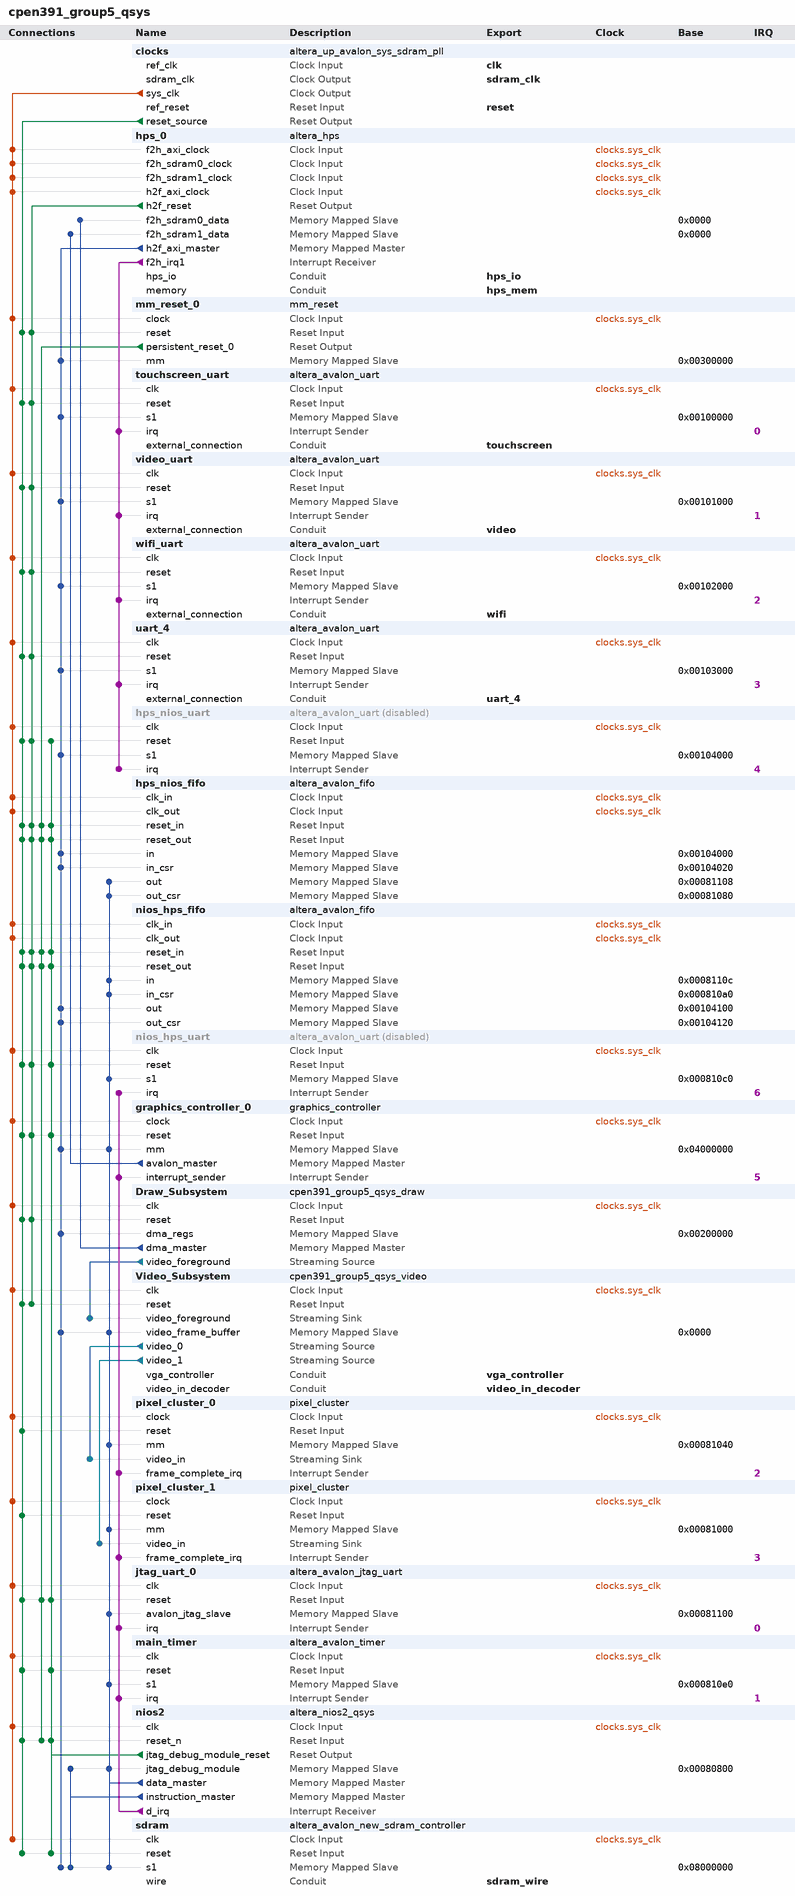
[diagram p0: system contents]
# Platform Designer (Qsys) system cpen391_group5_qsys, Cyclone V 5CSEMA5F31C6
# Parameters at their usual value, and those the tool derives, are not listed.
package require -exact qsys 15.0
create_system cpen391_group5_qsys
set_project_property DEVICE_FAMILY {Cyclone V}
set_project_property DEVICE 5CSEMA5F31C6

add_instance clocks altera_up_avalon_sys_sdram_pll 15.0
set_instance_parameter_value clocks CV_boards DE1-SoC
set_instance_parameter_value clocks gui_outclk 50.0
set_instance_parameter_value clocks gui_refclk 50.0

add_instance hps_0 altera_hps 15.0
set_instance_parameter_value hps_0 EMAC1_Mode RGMII
set_instance_parameter_value hps_0 EMAC1_PinMuxing {HPS I/O Set 0}
set_instance_parameter_value hps_0 F2SCLK_COLDRST_Enable false
set_instance_parameter_value hps_0 F2SCLK_DBGRST_Enable false
set_instance_parameter_value hps_0 F2SCLK_WARMRST_Enable false
set_instance_parameter_value hps_0 F2SDRAM_Type {Avalon-MM Bidirectional,Avalon-MM Bidirectional}
set_instance_parameter_value hps_0 F2SDRAM_Width 64,64
set_instance_parameter_value hps_0 F2SINTERRUPT_Enable true
set_instance_parameter_value hps_0 F2S_Width 1
set_instance_parameter_value hps_0 FPGA_PERIPHERAL_OUTPUT_CLOCK_FREQ_EMAC0_GTX_CLK 100
set_instance_parameter_value hps_0 FPGA_PERIPHERAL_OUTPUT_CLOCK_FREQ_EMAC0_MD_CLK 2.5
set_instance_parameter_value hps_0 FPGA_PERIPHERAL_OUTPUT_CLOCK_FREQ_EMAC1_GTX_CLK 100
set_instance_parameter_value hps_0 FPGA_PERIPHERAL_OUTPUT_CLOCK_FREQ_EMAC1_MD_CLK 2.5
set_instance_parameter_value hps_0 HPS_PROTOCOL DDR3
set_instance_parameter_value hps_0 I2C0_Mode I2C
set_instance_parameter_value hps_0 I2C0_PinMuxing {HPS I/O Set 1}
set_instance_parameter_value hps_0 I2C1_Mode N/A
set_instance_parameter_value hps_0 I2C1_PinMuxing Unused
set_instance_parameter_value hps_0 LWH2F_Enable false
set_instance_parameter_value hps_0 MEM_BANKADDR_WIDTH 3
set_instance_parameter_value hps_0 MEM_CLK_FREQ 400.0
set_instance_parameter_value hps_0 MEM_COL_ADDR_WIDTH 10
set_instance_parameter_value hps_0 MEM_DQ_WIDTH 32
set_instance_parameter_value hps_0 MEM_DRV_STR RZQ/7
set_instance_parameter_value hps_0 MEM_ROW_ADDR_WIDTH 15
set_instance_parameter_value hps_0 MEM_RTT_NOM RZQ/4
set_instance_parameter_value hps_0 MEM_RTT_WR RZQ/4
set_instance_parameter_value hps_0 MEM_TCL 11
set_instance_parameter_value hps_0 MEM_TFAW_NS 30.0
set_instance_parameter_value hps_0 MEM_TRAS_NS 35.0
set_instance_parameter_value hps_0 MEM_TRCD_NS 13.75
set_instance_parameter_value hps_0 MEM_TRFC_NS 260.0
set_instance_parameter_value hps_0 MEM_TRP_NS 13.75
set_instance_parameter_value hps_0 MEM_VENDOR Other
set_instance_parameter_value hps_0 MEM_WTCL 8
set_instance_parameter_value hps_0 QSPI_Mode {1 SS}
set_instance_parameter_value hps_0 QSPI_PinMuxing {HPS I/O Set 0}
set_instance_parameter_value hps_0 REF_CLK_FREQ 25.0
set_instance_parameter_value hps_0 S2F_Width 1
set_instance_parameter_value hps_0 SDIO_Mode {4-bit Data}
set_instance_parameter_value hps_0 SDIO_PinMuxing {HPS I/O Set 0}
set_instance_parameter_value hps_0 SPIM1_Mode N/A
set_instance_parameter_value hps_0 SPIM1_PinMuxing Unused
set_instance_parameter_value hps_0 STM_Enable false
set_instance_parameter_value hps_0 TIMING_BOARD_AC_SKEW 0.02
set_instance_parameter_value hps_0 TIMING_BOARD_AC_TO_CK_SKEW 0.01
set_instance_parameter_value hps_0 TIMING_BOARD_DQ_TO_DQS_SKEW 0.05
set_instance_parameter_value hps_0 TIMING_BOARD_MAX_CK_DELAY 0.03
set_instance_parameter_value hps_0 TIMING_BOARD_MAX_DQS_DELAY 0.02
set_instance_parameter_value hps_0 TIMING_BOARD_SKEW_BETWEEN_DQS 0.06
set_instance_parameter_value hps_0 TIMING_BOARD_SKEW_CKDQS_DIMM_MAX 0.12
set_instance_parameter_value hps_0 TIMING_BOARD_SKEW_CKDQS_DIMM_MIN 0.06
set_instance_parameter_value hps_0 TIMING_BOARD_SKEW_WITHIN_DQS 0.01
set_instance_parameter_value hps_0 TIMING_TDH 65
set_instance_parameter_value hps_0 TIMING_TDQSCK 255
set_instance_parameter_value hps_0 TIMING_TDQSQ 125
set_instance_parameter_value hps_0 TIMING_TDS 30
set_instance_parameter_value hps_0 TIMING_TIH 140
set_instance_parameter_value hps_0 TIMING_TIS 180
set_instance_parameter_value hps_0 TIMING_TQSH 0.4
set_instance_parameter_value hps_0 UART0_Mode {No Flow Control}
set_instance_parameter_value hps_0 UART0_PinMuxing {HPS I/O Set 2}
set_instance_parameter_value hps_0 USB1_Mode SDR
set_instance_parameter_value hps_0 USB1_PinMuxing {HPS I/O Set 0}
set_instance_parameter_value hps_0 desired_cfg_clk_mhz 100.0
set_instance_parameter_value hps_0 desired_qspi_clk_mhz 400.0

add_instance mm_reset_0 mm_reset 1.0
set_instance_parameter_value mm_reset_0 ADDR_BITS 2
set_instance_parameter_value mm_reset_0 CYCLES 1000000
set_instance_parameter_value mm_reset_0 N_REGS 4
set_instance_parameter_value mm_reset_0 REG_BITS 32

add_instance touchscreen_uart altera_avalon_uart 15.0
set_instance_parameter_value touchscreen_uart baud 9600
set_instance_parameter_value touchscreen_uart dataBits 8
set_instance_parameter_value touchscreen_uart fixedBaud false
set_instance_parameter_value touchscreen_uart parity NONE
set_instance_parameter_value touchscreen_uart stopBits 1

add_instance video_uart altera_avalon_uart 15.0
set_instance_parameter_value video_uart baud 38400
set_instance_parameter_value video_uart dataBits 8
set_instance_parameter_value video_uart fixedBaud false
set_instance_parameter_value video_uart parity NONE
set_instance_parameter_value video_uart stopBits 1

add_instance wifi_uart altera_avalon_uart 15.0
set_instance_parameter_value wifi_uart baud 115200
set_instance_parameter_value wifi_uart dataBits 8
set_instance_parameter_value wifi_uart fixedBaud false
set_instance_parameter_value wifi_uart parity NONE
set_instance_parameter_value wifi_uart stopBits 1

add_instance uart_4 altera_avalon_uart 15.0
set_instance_parameter_value uart_4 baud 115200
set_instance_parameter_value uart_4 dataBits 8
set_instance_parameter_value uart_4 fixedBaud false
set_instance_parameter_value uart_4 parity NONE
set_instance_parameter_value uart_4 stopBits 1

add_instance hps_nios_uart altera_avalon_uart 15.0
set_instance_property hps_nios_uart ENABLED false
set_instance_parameter_value hps_nios_uart baud 115200
set_instance_parameter_value hps_nios_uart dataBits 8
set_instance_parameter_value hps_nios_uart fixedBaud true
set_instance_parameter_value hps_nios_uart parity NONE
set_instance_parameter_value hps_nios_uart stopBits 1

add_instance hps_nios_fifo altera_avalon_fifo 15.0
set_instance_parameter_value hps_nios_fifo bitsPerSymbol 16
set_instance_parameter_value hps_nios_fifo channelWidth 8
set_instance_parameter_value hps_nios_fifo errorWidth 8
set_instance_parameter_value hps_nios_fifo fifoDepth 64
set_instance_parameter_value hps_nios_fifo fifoInputInterfaceOptions AVALONMM_WRITE
set_instance_parameter_value hps_nios_fifo fifoOutputInterfaceOptions AVALONMM_READ
set_instance_parameter_value hps_nios_fifo singleClockMode false
set_instance_parameter_value hps_nios_fifo symbolsPerBeat 2
set_instance_parameter_value hps_nios_fifo useBackpressure false
set_instance_parameter_value hps_nios_fifo useIRQ false
set_instance_parameter_value hps_nios_fifo usePacket true
set_instance_parameter_value hps_nios_fifo useReadControl true

add_instance nios_hps_fifo altera_avalon_fifo 15.0
set_instance_parameter_value nios_hps_fifo bitsPerSymbol 16
set_instance_parameter_value nios_hps_fifo channelWidth 8
set_instance_parameter_value nios_hps_fifo errorWidth 8
set_instance_parameter_value nios_hps_fifo fifoDepth 64
set_instance_parameter_value nios_hps_fifo fifoInputInterfaceOptions AVALONMM_WRITE
set_instance_parameter_value nios_hps_fifo fifoOutputInterfaceOptions AVALONMM_READ
set_instance_parameter_value nios_hps_fifo singleClockMode false
set_instance_parameter_value nios_hps_fifo symbolsPerBeat 2
set_instance_parameter_value nios_hps_fifo useBackpressure false
set_instance_parameter_value nios_hps_fifo useIRQ false
set_instance_parameter_value nios_hps_fifo usePacket true
set_instance_parameter_value nios_hps_fifo useReadControl true

add_instance nios_hps_uart altera_avalon_uart 15.0
set_instance_property nios_hps_uart ENABLED false
set_instance_parameter_value nios_hps_uart baud 115200
set_instance_parameter_value nios_hps_uart dataBits 8
set_instance_parameter_value nios_hps_uart fixedBaud true
set_instance_parameter_value nios_hps_uart parity NONE
set_instance_parameter_value nios_hps_uart stopBits 1

add_instance graphics_controller_0 graphics_controller 1.0
set_instance_parameter_value graphics_controller_0 pixel_idle 0
set_instance_parameter_value graphics_controller_0 pixel_write 1
set_instance_parameter_value graphics_controller_0 rec_cmp_x 3
set_instance_parameter_value graphics_controller_0 rec_cmp_y 5
set_instance_parameter_value graphics_controller_0 rec_idle 0
set_instance_parameter_value graphics_controller_0 rec_inc_x 12
set_instance_parameter_value graphics_controller_0 rec_inc_y 22
set_instance_parameter_value graphics_controller_0 rec_init 1
set_instance_parameter_value graphics_controller_0 rec_write 34

add_instance Draw_Subsystem cpen391_group5_qsys_draw 1.0

add_instance Video_Subsystem cpen391_group5_qsys_video 1.0

add_instance pixel_cluster_0 pixel_cluster 1.0
set_instance_parameter_value pixel_cluster_0 ADDR_BITS 4
set_instance_parameter_value pixel_cluster_0 COLOR_BITS 8
set_instance_parameter_value pixel_cluster_0 COUNTER_BITS 16
set_instance_parameter_value pixel_cluster_0 N_CLUSTERS 4
set_instance_parameter_value pixel_cluster_0 N_COLORS 3
set_instance_parameter_value pixel_cluster_0 REG_BITS 32
set_instance_parameter_value pixel_cluster_0 X_MAX 320
set_instance_parameter_value pixel_cluster_0 X_Y_BITS 16
set_instance_parameter_value pixel_cluster_0 Y_MAX 240

add_instance pixel_cluster_1 pixel_cluster 1.0
set_instance_parameter_value pixel_cluster_1 ADDR_BITS 4
set_instance_parameter_value pixel_cluster_1 COLOR_BITS 8
set_instance_parameter_value pixel_cluster_1 COUNTER_BITS 16
set_instance_parameter_value pixel_cluster_1 N_CLUSTERS 4
set_instance_parameter_value pixel_cluster_1 N_COLORS 3
set_instance_parameter_value pixel_cluster_1 REG_BITS 32
set_instance_parameter_value pixel_cluster_1 X_MAX 320
set_instance_parameter_value pixel_cluster_1 X_Y_BITS 16
set_instance_parameter_value pixel_cluster_1 Y_MAX 240

add_instance jtag_uart_0 altera_avalon_jtag_uart 15.0
set_instance_parameter_value jtag_uart_0 simInteractiveOptions NO_INTERACTIVE_WINDOWS

add_instance main_timer altera_avalon_timer 15.0
set_instance_parameter_value main_timer period 1
set_instance_parameter_value main_timer periodUnits MSEC

add_instance nios2 altera_nios2_qsys 15.0
set_instance_parameter_value nios2 breakSlave nios2.jtag_debug_module
set_instance_parameter_value nios2 dcache_bursts true
set_instance_parameter_value nios2 dcache_size 1024
set_instance_parameter_value nios2 dcache_victim_buf_impl reg
set_instance_parameter_value nios2 exceptionSlave sdram.s1
set_instance_parameter_value nios2 icache_size 1024
set_instance_parameter_value nios2 impl Tiny
set_instance_parameter_value nios2 mmu_TLBMissExcSlave None
set_instance_parameter_value nios2 resetSlave sdram.s1
set_instance_parameter_value nios2 resetrequest_enabled true

add_instance sdram altera_avalon_new_sdram_controller 15.0
set_instance_parameter_value sdram TAC 5.4
set_instance_parameter_value sdram TRCD 15.0
set_instance_parameter_value sdram TRP 15.0
set_instance_parameter_value sdram casLatency 3
set_instance_parameter_value sdram columnWidth 10
set_instance_parameter_value sdram dataWidth 16
set_instance_parameter_value sdram generateSimulationModel false
set_instance_parameter_value sdram model single_Micron_MT48LC4M32B2_7_chip
set_instance_parameter_value sdram numberOfBanks 4
set_instance_parameter_value sdram numberOfChipSelects 1
set_instance_parameter_value sdram powerUpDelay 100.0
set_instance_parameter_value sdram refreshPeriod 7.8125
set_instance_parameter_value sdram rowWidth 13

# connections
add_connection clocks.sys_clk Draw_Subsystem.clk clock
add_connection clocks.sys_clk graphics_controller_0.clock clock
add_connection clocks.sys_clk hps_0.f2h_axi_clock clock
add_connection clocks.sys_clk hps_0.f2h_sdram0_clock clock
add_connection clocks.sys_clk hps_0.f2h_sdram1_clock clock
add_connection clocks.sys_clk hps_0.h2f_axi_clock clock
add_connection clocks.sys_clk hps_nios_fifo.clk_in clock
add_connection clocks.sys_clk hps_nios_fifo.clk_out clock
add_connection clocks.sys_clk hps_nios_uart.clk clock
add_connection clocks.sys_clk jtag_uart_0.clk clock
add_connection clocks.sys_clk main_timer.clk clock
add_connection clocks.sys_clk mm_reset_0.clock clock
add_connection clocks.sys_clk nios2.clk clock
add_connection clocks.sys_clk nios_hps_fifo.clk_in clock
add_connection clocks.sys_clk nios_hps_fifo.clk_out clock
add_connection clocks.sys_clk nios_hps_uart.clk clock
add_connection clocks.sys_clk pixel_cluster_0.clock clock
add_connection clocks.sys_clk pixel_cluster_1.clock clock
add_connection clocks.sys_clk sdram.clk clock
add_connection clocks.sys_clk touchscreen_uart.clk clock
add_connection clocks.sys_clk uart_4.clk clock
add_connection clocks.sys_clk Video_Subsystem.clk clock
add_connection clocks.sys_clk video_uart.clk clock
add_connection clocks.sys_clk wifi_uart.clk clock
add_connection clocks.reset_source Draw_Subsystem.reset reset
add_connection clocks.reset_source graphics_controller_0.reset reset
add_connection clocks.reset_source hps_nios_fifo.reset_in reset
add_connection clocks.reset_source hps_nios_fifo.reset_out reset
add_connection clocks.reset_source hps_nios_uart.reset reset
add_connection clocks.reset_source jtag_uart_0.reset reset
add_connection clocks.reset_source main_timer.reset reset
add_connection clocks.reset_source mm_reset_0.reset reset
add_connection clocks.reset_source nios2.reset_n reset
add_connection clocks.reset_source nios_hps_fifo.reset_in reset
add_connection clocks.reset_source nios_hps_fifo.reset_out reset
add_connection clocks.reset_source nios_hps_uart.reset reset
add_connection clocks.reset_source pixel_cluster_0.reset reset
add_connection clocks.reset_source pixel_cluster_1.reset reset
add_connection clocks.reset_source sdram.reset reset
add_connection clocks.reset_source touchscreen_uart.reset reset
add_connection clocks.reset_source uart_4.reset reset
add_connection clocks.reset_source Video_Subsystem.reset reset
add_connection clocks.reset_source video_uart.reset reset
add_connection clocks.reset_source wifi_uart.reset reset
add_connection hps_0.h2f_reset Draw_Subsystem.reset reset
add_connection hps_0.h2f_reset graphics_controller_0.reset reset
add_connection hps_0.h2f_reset hps_nios_fifo.reset_in reset
add_connection hps_0.h2f_reset hps_nios_fifo.reset_out reset
add_connection hps_0.h2f_reset hps_nios_uart.reset reset
add_connection hps_0.h2f_reset mm_reset_0.reset reset
add_connection hps_0.h2f_reset nios_hps_fifo.reset_in reset
add_connection hps_0.h2f_reset nios_hps_fifo.reset_out reset
add_connection hps_0.h2f_reset nios_hps_uart.reset reset
add_connection hps_0.h2f_reset touchscreen_uart.reset reset
add_connection hps_0.h2f_reset uart_4.reset reset
add_connection hps_0.h2f_reset Video_Subsystem.reset reset
add_connection hps_0.h2f_reset video_uart.reset reset
add_connection hps_0.h2f_reset wifi_uart.reset reset
add_connection mm_reset_0.persistent_reset_0 hps_nios_fifo.reset_in reset
add_connection mm_reset_0.persistent_reset_0 hps_nios_fifo.reset_out reset
add_connection mm_reset_0.persistent_reset_0 jtag_uart_0.reset reset
add_connection mm_reset_0.persistent_reset_0 nios2.reset_n reset
add_connection mm_reset_0.persistent_reset_0 nios_hps_fifo.reset_in reset
add_connection mm_reset_0.persistent_reset_0 nios_hps_fifo.reset_out reset
add_connection nios2.jtag_debug_module_reset graphics_controller_0.reset reset
add_connection nios2.jtag_debug_module_reset hps_nios_fifo.reset_in reset
add_connection nios2.jtag_debug_module_reset hps_nios_fifo.reset_out reset
add_connection nios2.jtag_debug_module_reset hps_nios_uart.reset reset
add_connection nios2.jtag_debug_module_reset jtag_uart_0.reset reset
add_connection nios2.jtag_debug_module_reset main_timer.reset reset
add_connection nios2.jtag_debug_module_reset nios2.reset_n reset
add_connection nios2.jtag_debug_module_reset nios_hps_fifo.reset_in reset
add_connection nios2.jtag_debug_module_reset nios_hps_fifo.reset_out reset
add_connection nios2.jtag_debug_module_reset nios_hps_uart.reset reset
add_connection nios2.jtag_debug_module_reset sdram.reset reset
add_connection Draw_Subsystem.dma_master hps_0.f2h_sdram0_data avalon
set_connection_parameter_value Draw_Subsystem.dma_master/hps_0.f2h_sdram0_data baseAddress 0x0000
add_connection graphics_controller_0.avalon_master hps_0.f2h_sdram1_data avalon
set_connection_parameter_value graphics_controller_0.avalon_master/hps_0.f2h_sdram1_data baseAddress 0x0000
add_connection hps_0.h2f_axi_master Draw_Subsystem.dma_regs avalon
set_connection_parameter_value hps_0.h2f_axi_master/Draw_Subsystem.dma_regs baseAddress 0x00200000
add_connection hps_0.h2f_axi_master graphics_controller_0.mm avalon
set_connection_parameter_value hps_0.h2f_axi_master/graphics_controller_0.mm baseAddress 0x04000000
add_connection hps_0.h2f_axi_master hps_nios_fifo.in avalon
set_connection_parameter_value hps_0.h2f_axi_master/hps_nios_fifo.in baseAddress 0x00104000
add_connection hps_0.h2f_axi_master hps_nios_fifo.in_csr avalon
set_connection_parameter_value hps_0.h2f_axi_master/hps_nios_fifo.in_csr baseAddress 0x00104020
add_connection hps_0.h2f_axi_master hps_nios_uart.s1 avalon
set_connection_parameter_value hps_0.h2f_axi_master/hps_nios_uart.s1 baseAddress 0x00104000
add_connection hps_0.h2f_axi_master mm_reset_0.mm avalon
set_connection_parameter_value hps_0.h2f_axi_master/mm_reset_0.mm baseAddress 0x00300000
add_connection hps_0.h2f_axi_master nios_hps_fifo.out avalon
set_connection_parameter_value hps_0.h2f_axi_master/nios_hps_fifo.out baseAddress 0x00104100
add_connection hps_0.h2f_axi_master nios_hps_fifo.out_csr avalon
set_connection_parameter_value hps_0.h2f_axi_master/nios_hps_fifo.out_csr baseAddress 0x00104120
add_connection hps_0.h2f_axi_master sdram.s1 avalon
set_connection_parameter_value hps_0.h2f_axi_master/sdram.s1 baseAddress 0x08000000
add_connection hps_0.h2f_axi_master touchscreen_uart.s1 avalon
set_connection_parameter_value hps_0.h2f_axi_master/touchscreen_uart.s1 baseAddress 0x00100000
add_connection hps_0.h2f_axi_master uart_4.s1 avalon
set_connection_parameter_value hps_0.h2f_axi_master/uart_4.s1 baseAddress 0x00103000
add_connection hps_0.h2f_axi_master Video_Subsystem.video_frame_buffer avalon
set_connection_parameter_value hps_0.h2f_axi_master/Video_Subsystem.video_frame_buffer baseAddress 0x0000
add_connection hps_0.h2f_axi_master video_uart.s1 avalon
set_connection_parameter_value hps_0.h2f_axi_master/video_uart.s1 baseAddress 0x00101000
add_connection hps_0.h2f_axi_master wifi_uart.s1 avalon
set_connection_parameter_value hps_0.h2f_axi_master/wifi_uart.s1 baseAddress 0x00102000
add_connection nios2.data_master graphics_controller_0.mm avalon
set_connection_parameter_value nios2.data_master/graphics_controller_0.mm baseAddress 0x04000000
add_connection nios2.data_master hps_nios_fifo.out avalon
set_connection_parameter_value nios2.data_master/hps_nios_fifo.out baseAddress 0x00081108
add_connection nios2.data_master hps_nios_fifo.out_csr avalon
set_connection_parameter_value nios2.data_master/hps_nios_fifo.out_csr baseAddress 0x00081080
add_connection nios2.data_master jtag_uart_0.avalon_jtag_slave avalon
set_connection_parameter_value nios2.data_master/jtag_uart_0.avalon_jtag_slave baseAddress 0x00081100
add_connection nios2.data_master main_timer.s1 avalon
set_connection_parameter_value nios2.data_master/main_timer.s1 baseAddress 0x000810e0
add_connection nios2.data_master nios2.jtag_debug_module avalon
set_connection_parameter_value nios2.data_master/nios2.jtag_debug_module baseAddress 0x00080800
add_connection nios2.data_master nios_hps_fifo.in avalon
set_connection_parameter_value nios2.data_master/nios_hps_fifo.in baseAddress 0x0008110c
add_connection nios2.data_master nios_hps_fifo.in_csr avalon
set_connection_parameter_value nios2.data_master/nios_hps_fifo.in_csr baseAddress 0x000810a0
add_connection nios2.data_master nios_hps_uart.s1 avalon
set_connection_parameter_value nios2.data_master/nios_hps_uart.s1 baseAddress 0x000810c0
add_connection nios2.data_master pixel_cluster_0.mm avalon
set_connection_parameter_value nios2.data_master/pixel_cluster_0.mm baseAddress 0x00081040
add_connection nios2.data_master pixel_cluster_1.mm avalon
set_connection_parameter_value nios2.data_master/pixel_cluster_1.mm baseAddress 0x00081000
add_connection nios2.data_master sdram.s1 avalon
set_connection_parameter_value nios2.data_master/sdram.s1 baseAddress 0x08000000
add_connection nios2.data_master Video_Subsystem.video_frame_buffer avalon
set_connection_parameter_value nios2.data_master/Video_Subsystem.video_frame_buffer baseAddress 0x0000
add_connection nios2.instruction_master nios2.jtag_debug_module avalon
set_connection_parameter_value nios2.instruction_master/nios2.jtag_debug_module baseAddress 0x00080800
add_connection nios2.instruction_master sdram.s1 avalon
set_connection_parameter_value nios2.instruction_master/sdram.s1 baseAddress 0x08000000
add_connection Draw_Subsystem.video_foreground Video_Subsystem.video_foreground avalon_streaming
add_connection Video_Subsystem.video_0 pixel_cluster_0.video_in avalon_streaming
add_connection Video_Subsystem.video_1 pixel_cluster_1.video_in avalon_streaming
add_connection hps_0.f2h_irq1 hps_nios_uart.irq interrupt
set_connection_parameter_value hps_0.f2h_irq1/hps_nios_uart.irq irqNumber 4
add_connection hps_0.f2h_irq1 touchscreen_uart.irq interrupt
set_connection_parameter_value hps_0.f2h_irq1/touchscreen_uart.irq irqNumber 0
add_connection hps_0.f2h_irq1 uart_4.irq interrupt
set_connection_parameter_value hps_0.f2h_irq1/uart_4.irq irqNumber 3
add_connection hps_0.f2h_irq1 video_uart.irq interrupt
set_connection_parameter_value hps_0.f2h_irq1/video_uart.irq irqNumber 1
add_connection hps_0.f2h_irq1 wifi_uart.irq interrupt
set_connection_parameter_value hps_0.f2h_irq1/wifi_uart.irq irqNumber 2
add_connection nios2.d_irq graphics_controller_0.interrupt_sender interrupt
set_connection_parameter_value nios2.d_irq/graphics_controller_0.interrupt_sender irqNumber 5
add_connection nios2.d_irq jtag_uart_0.irq interrupt
set_connection_parameter_value nios2.d_irq/jtag_uart_0.irq irqNumber 0
add_connection nios2.d_irq main_timer.irq interrupt
set_connection_parameter_value nios2.d_irq/main_timer.irq irqNumber 1
add_connection nios2.d_irq nios_hps_uart.irq interrupt
set_connection_parameter_value nios2.d_irq/nios_hps_uart.irq irqNumber 6
add_connection nios2.d_irq pixel_cluster_0.frame_complete_irq interrupt
set_connection_parameter_value nios2.d_irq/pixel_cluster_0.frame_complete_irq irqNumber 2
add_connection nios2.d_irq pixel_cluster_1.frame_complete_irq interrupt
set_connection_parameter_value nios2.d_irq/pixel_cluster_1.frame_complete_irq irqNumber 3

# exported interfaces
add_interface clk clock sink
set_interface_property clk EXPORT_OF clocks.ref_clk
add_interface hps_io conduit end
set_interface_property hps_io EXPORT_OF hps_0.hps_io
add_interface hps_mem conduit end
set_interface_property hps_mem EXPORT_OF hps_0.memory
add_interface reset reset sink
set_interface_property reset EXPORT_OF clocks.ref_reset
add_interface sdram_clk clock source
set_interface_property sdram_clk EXPORT_OF clocks.sdram_clk
add_interface sdram_wire conduit end
set_interface_property sdram_wire EXPORT_OF sdram.wire
add_interface touchscreen conduit end
set_interface_property touchscreen EXPORT_OF touchscreen_uart.external_connection
add_interface uart_4 conduit end
set_interface_property uart_4 EXPORT_OF uart_4.external_connection
add_interface vga_controller conduit end
set_interface_property vga_controller EXPORT_OF Video_Subsystem.vga_controller
add_interface video conduit end
set_interface_property video EXPORT_OF video_uart.external_connection
add_interface video_in_decoder conduit end
set_interface_property video_in_decoder EXPORT_OF Video_Subsystem.video_in_decoder
add_interface wifi conduit end
set_interface_property wifi EXPORT_OF wifi_uart.external_connection

set_interconnect_requirement {$system} qsys_mm.clockCrossingAdapter HANDSHAKE
set_interconnect_requirement {$system} qsys_mm.enableEccProtection FALSE
set_interconnect_requirement {$system} qsys_mm.insertDefaultSlave FALSE
set_interconnect_requirement {$system} qsys_mm.maxAdditionalLatency 1

save_system cpen391_group5_qsys.qsys
